# EAGLE design PhaetonArduinoBrd (EAGLE 7.4.0)
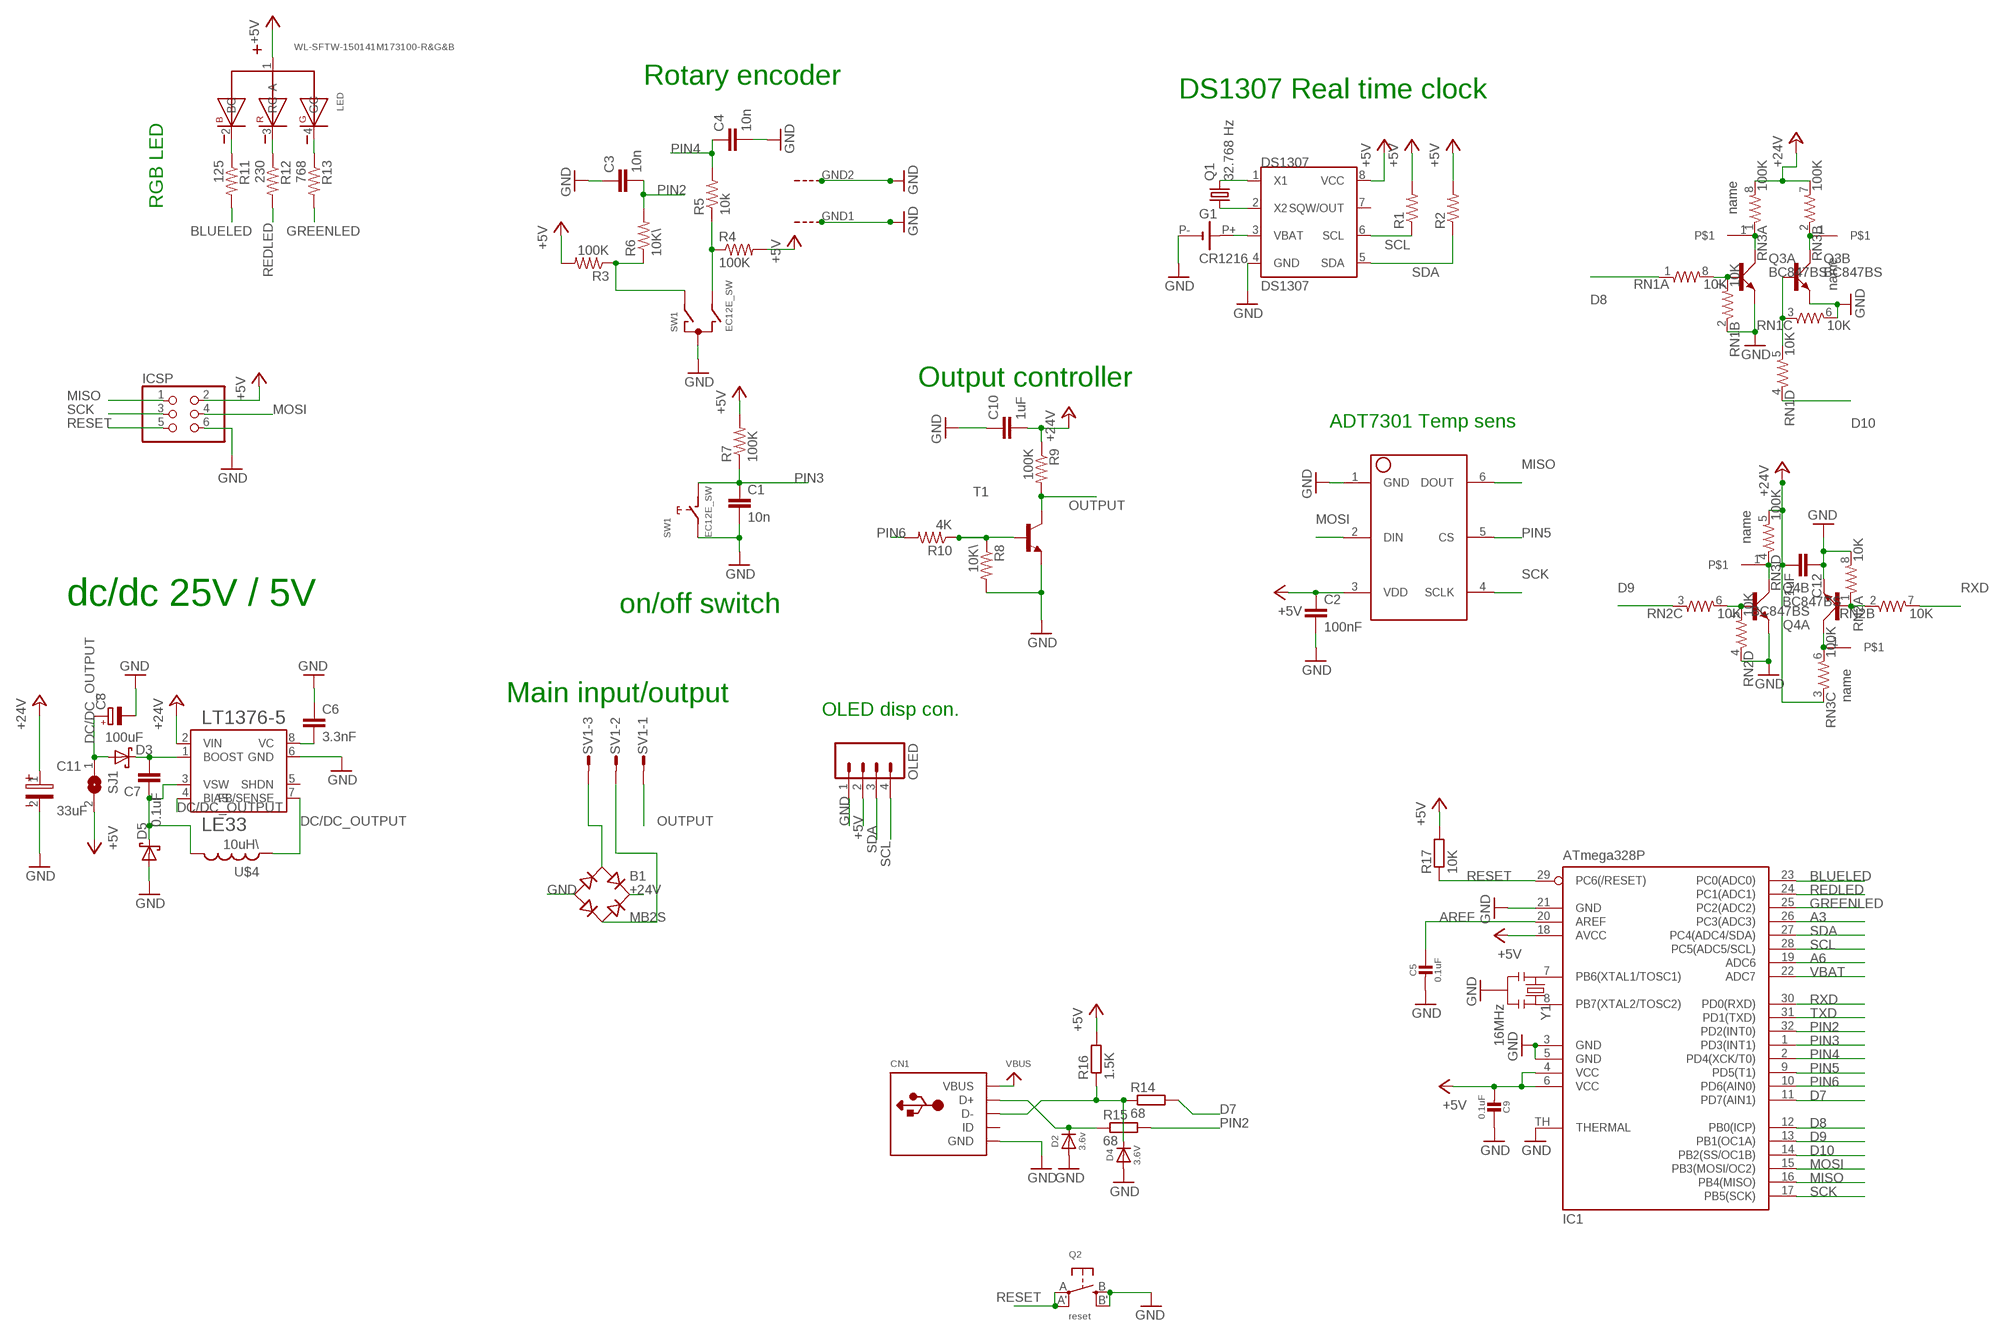
[diagram p0: schematic, sheet 1]

## Parts
ADT  ADT7301  [SOT23-6]
B1  MB2S  [SOIC-4]
C1  10n  C-EUC0504  [C0504]
C2  100nF  C-EUC0504  [C0504]
C3  10n  C-EUC0504  [C0504]
C4  10n  C-EUC0504  [C0504]
C5  0.1uF  CAP_CERAMIC_0805MP  [_0805MP]
C6  3.3nF  C-EUC0504  [C0504]
C7  0.1uF  C-EUC0504  [C0504]
C8  100uF  CPOL-EUCT7343  [CT7343]
C9  0.1uF  CAP_CERAMIC_0805MP  [_0805MP]
C10  1uF  C-EUC0402  [C0402]
C11  33uF  WCAP-ASLI_5X5.5(DXL)  [3X1.6X1.4(BXCXA)]
C12  1uF  C-EUC0402  [C0402]
CN1  USBMINIB  [USB-MINIB]
D2  3.6v  DIODESOD-323  [SOD-323]
D3  SCHOTTKY  [DO214]
D4  3.6V  DIODESOD-323  [SOD-323]
D5  SCHOTTKY  [DO214]
DS1307  DS1307  [SOIC-8]
G1  CR1216  [SMTU1225-LF]
IC1  ATmega328P  MEGA8-MI  [MLF32-TH]
ICSP  PINHD-2X3  [2X03]
LED  WL-SFTW-150141M173100-R&G&B  [3528-COMMON-ANODE]
LT1376-5  LE33  [SO08]
OLED  M04  [04P]
OUTPUT2  MINICONECTOR  [SMD]
Q1  32.768 Hz  CRYSTALTC26V  [TC26V]
Q2  reset  SWITCH_TACT_SMT4.6X2.8  [BTN_KMR2_4.6X2.8]
Q3  BC847BS  [SOT363_PHILIPS]
Q4  BC847BS  [SOT363_PHILIPS]
R1  RESISTOR  [0805]
R2  RESISTOR  [0805]
R3  100K  RESISTOR  [0805]
R4  100K  RESISTOR  [0805]
R5  10k  RESISTOR  [0805]
R6  10K\  RESISTOR  [0805]
R7  100K  RESISTOR  [0805]
R8  10K\  RESISTOR  [0805]
R9  100K  RESISTOR  [0805]
R10  4K  RESISTOR  [0805]
R11  125  RESISTOR  [0805]
R12  230  RESISTOR  [0805]
R13  768  RESISTOR  [0805]
R14  68  R-EU_R0603  [R0603]
R15  68  R-EU_R0603  [R0603]
R16  1.5K  R-EU_R0603  [R0603]
R17  10K  R-EU_R0603  [R0603]
RN1  10K  741-8_S  [741-8]
RN2  10K  741-8_S  [741-8]
RN3  100K  741-8_S  [741-8]
SJ1  SJ  [SJ]
SV1  MT6-3  [MT6-3]
SW1  EC12E_SW  [ALPS_EC12E_SW]
T1  BC818-16-NPN-SOT23-BEC  [SOT23-BEC]
U$3  MINICONECTOR  [SMD]
U$4  10uH\  LPS3314-103MRB  [103MRB]
U$5  MINICONECTOR  [SMD]
U$6  MINICONECTOR  [SMD]
Y1  16MHz  RESONATORSMD  [RESONATOR-SMD]

## Nets
+5V: ADT.3(VDD) C2.1 C9.2 DS1307.8(VCC) IC1.4(VCC) IC1.6(VCC) IC1.18(AVCC) ICSP.2 LED.1(A) OLED.2 R1.2 R2.2 R3.2 R4.2 R7.2 R16.2 R17.2 SJ1.2
+24V: B1.+ C10.2 C11.1 C12.2 LT1376-5.2(VIN) R9.1 RN3.3 RN3.5 RN3.7 RN3.8
A3: IC1.26(PC3(ADC3))
A6: IC1.19(ADC6)
AREF: C5.1 IC1.20(AREF)
BLUELED: IC1.23(PC0(ADC0)) R11.2
D7: IC1.11(PD7(AIN1)) R14.2
D8: IC1.12(PB0(ICP)) RN1.1
D9: IC1.13(PB1(OC1A)) RN2.3
D10: IC1.14(PB2(SS/OC1B)) RN1.4
D+: CN1.D+ D2.C R15.1
D-: CN1.D- D4.C R14.1 R16.1
DC/DC_OUTPUT: C8.+ D3.A LT1376-5.4(BIAS) LT1376-5.7(FB/SENSE) SJ1.1 U$4.2
GND: ADT.1(GND) B1.- C1.2 C2.2 C3.1 C4.2 C5.2 C6.1 C8.- C9.1 C10.1 C11.2 C12.1 CN1.GND D2.A D4.A D5.A DS1307.4(GND) G1.P-(-) IC1.3(GND) IC1.5(GND) IC1.21(GND) IC1.TH(THERMAL) ICSP.6 LT1376-5.6(GND) OLED.1 Q2.B'(S1) Q2.B(S) Q3.1(A:E) Q3.4(B:E) Q4.1(A:E) Q4.4(B:E) R8.2 RN1.2 RN1.6 RN2.4 RN2.8 SW1.C SW1.E SW1.GND1(G) SW1.GND2(G) T1.E Y1.2
GREENLED: IC1.25(PC2(ADC2)) R13.2
MISO: ADT.6(DOUT) IC1.16(PB4(MISO)) ICSP.1
MOSI: ADT.2(DIN) IC1.15(PB3(MOSI/OC2)) ICSP.4
N$1: LED.2(BC) R11.1
N$2: LED.3(RC) R12.1
N$3: LED.4(GC) R13.1
N$4: B1.~1(AC1) SV1.3
N$5: DS1307.2(X2) Q1.1
N$6: B1.~2(AC2) SV1.2
N$7: IC1.8(PB7(XTAL2/TOSC2)) Y1.3
N$8: IC1.7(PB6(XTAL1/TOSC1)) Y1.1
N$9: R8.1 R10.1 T1.B
N$10: OUTPUT2.1 Q3.6(A:C) RN3.1
N$11: C6.2 LT1376-5.8(VC)
N$12: C7.2 D3.C LT1376-5.1(BOOST)
N$13: Q3.3(B:C) RN3.2 U$3.1
N$14: C7.1 D5.C LT1376-5.3(VSW) U$4.1
N$15: Q4.2(A:B) RN2.1 RN2.2
N$16: Q3.2(A:B) RN1.7 RN1.8
N$17: Q3.5(B:B) RN1.3 RN1.5
N$18: Q4.5(B:B) RN2.5 RN2.6
N$19: Q4.3(B:C) RN3.4 U$6.1
N$20: Q4.6(A:C) RN3.6 U$5.1
N$21: R3.1 R6.1 SW1.A
N$22: R4.1 R5.1 SW1.B
N$24: DS1307.1(X1) Q1.2
OUTPUT: R9.2 SV1.1 T1.C
PIN2: C3.2 IC1.32(PD2(INT0)) R6.2 R15.2
PIN3: C1.1 IC1.1(PD3(INT1)) R7.1 SW1.D
PIN4: C4.1 IC1.2(PD4(XCK/T0)) R5.2
PIN5: ADT.5(CS) IC1.9(PD5(T1))
PIN6: IC1.10(PD6(AIN0)) R10.2
REDLED: IC1.24(PC1(ADC1)) R12.2
RESET: IC1.29(PC6(/RESET)) ICSP.5 Q2.A'(P1) Q2.A(P) R17.1
RXD: IC1.30(PD0(RXD)) RN2.7
SCK: ADT.4(SCLK) IC1.17(PB5(SCK)) ICSP.3
SCL: DS1307.6(SCL) IC1.28(PC5(ADC5/SCL)) OLED.4 R1.1
SDA: DS1307.5(SDA) IC1.27(PC4(ADC4/SDA)) OLED.3 R2.1
TXD: IC1.31(PD1(TXD))
VBAT: DS1307.3(VBAT) G1.P+(+) IC1.22(ADC7)
VBUS [power]: CN1.VBUS
Unconnected: CN1.ID DS1307.7(SQW/OUT)

## Notes on the sheet
- Rotary encoder
- DS1307 Real time clock
- RGB LED
- Output controller
- ADT7301 Temp sens
- on/off switch
- dc/dc 25V / 5V
- Main input/output
- OLED disp con.

## Power pins joined to a net without a drawn wire
SHDN: LT1376-5.5(SHDN)

## Library data of the parts
ADT = analogLIB:ADT7301
B1 = rectifier:MB*S: Bridge Rectifier Source: http://www.fairchildsemi.com/ds/MB/MB6S.pdf
C1-C4 C6 C7 = rcl:C-EU: CAPACITOR, European symbol
C5 C9 = microbuilder:CAP_CERAMIC: Ceramic Capacitors For new designs, use the packages preceded by an '_' character since they are more reliable: The following footprints should be used on most boards: _0402 - Standard footprint for regular board layouts _0603 - Standard footprint for regular board layouts _0805 - Standard footprint for regular board layouts _1206 - Standard footprint for regular board layouts For extremely tight-pitch boards where space is at a premium, the following 'micro-pitch' footprints can be used (smaller pads, no silkscreen outline, etc.): _0402MP - Micro-pitch footprint for very dense/compact boards _0603MP - Micro-pitch footprint for very dense/compact boards _0805MP - Micro-pitch footprint for very dense/compact boards _1206MP - Micro-pitch footprint for very dense/compact boards
C8 = rcl:CPOL-EU: POLARIZED CAPACITOR, European symbol
C10 C12 = resistor:C-EU: CAPACITOR, European symbol
C11 = Eagle_CAPACITORS:WCAP-ASLI: WCAP-ASLI Aluminum Electrolytic Capacitors Characteristics Aluminum Electrolytic Capacitor Recommended soldering: Reflow Operating temperature: -55 °C to +105 °C Low impedance product series Load life:2000 h @ +105 °C Package name and Variant abbreviation: Package: Package: B X C X A = length of the solder pad X width of the solder pad X pitch of the solder pad. Variant: D X L = Diameter of the body part X Height of the body part. <http://katalog.we-online.de/media/images/eisos/WCAP-ASLI_pf2.jpg> Details see: http://katalog.we-online.de/en/pbs/WCAP-ASLI?m Created: 2015-03-10 2015 (C) Wurth Elektronik
CN1 = microbuilder:USB: USB Connectors USBMINIB - Surface Mount Female Mini-B USB Connector 4UConnector: 06564
D2 D4 = microbuilder:DIODE: Diode SMA Model Volts Amps Type Vf Ir Digikey # Notes SSA34-E3 40V 3A Schottky 480mV @ 3A 200uA @ 40V SSA34-E3/61TGITR-ND CDBA120-G 20V 1A Schottky 500mV @ 1A 500uA @ 20V 641-1014-6-ND REEL MBRA210 10V 2A Schottky 350mV @ 2A 700uA @ 10V MBRA210LT3 SOD-123 Model Volts Amps Type Vf Ir Order # Notes BAT54T1G 30V 200mA Schottky 800mV @ 200mA 2uA @ 25V BAT54T1GOSTR-ND B0530W 30V 500mA Schottky 430mV @ 500mA 130uA @ 30V B0530W-FDICT-ND REEL MBR120 20V 1A Schottky 340mV @ 1A MBR120VLSFT1GOSCT-ND SOD-323 Model Volts Amps Type Vf Ir Order # Notes PMEG2005EJ 20V 500mA Schottky 355mV @ 500mA 568-4110-1-ND ZLLS410 10V 570mA Schottky 380mV @ 570mA ZLLS410CT-ND 1N4148WS 75V 150mA Silicon/Simple 1V 1N4148WSFSCT-ND REEL SOD-523 Model Volts Amps Type Vf Ir Order # Notes BAT54XV2 30V 200mA Schottky 0.8V @ 100mA BAT54XV2CT-ND TB751S 30V 30mA Schottky RB751S-40TE61CT-ND SOT23-R/W (R = Solder Paste/Reflow Ovens, W = Hand-Soldering) Model Volts Amps Type Vf Ir Order # Notes BAT54FILM 40V 300mA Schottky 497-7162-1-ND POWERDI-5 Model Volts Amps Type Vf Ir Order # Notes PDS560 60V 5A Schottky 670mV @ 5A 150uA @ 60V PDS560DICT-ND
D3 D5 = s1x_10:SCHOTTKY: S1A - S1M General Purpose Rectifiers Source: http://www.fairchildsemi.com/datasheets/S1/S1A.pdf
DS1307 = dallas:DS1307: I2C Serial RTC w/56 bytes battery backed RAM
G1 = battery:CR1216: LI BATTERY Sonnenschein
IC1 = microbuilder:MEGA8-MI: MICROCONTROLLER 8 Kbytes FLASH, 1 kbytes SRAM, 512 bytes EEPROM, USART, 6-channel 10 bit ADC, 2-channel 8 bit ADC Pin compatible with Atmega48, ATMega88, ATMega168 Source: avr.lbr; MPN: ATMEGA88PA-MU; OC_FARNELL: 1715491; OC_NEWARK: 15R0272
ICSP = SmartPrj:PINHD-2X3: PIN HEADER
LED = Wuerth_Elektronik_LEDs_rev15b:WL-SFTW: SMD full-color TOP LED Characteristics Low energy consumption High reliability Low current requirement Fast switching No UV/IR radiation High brightness RGB individual control Compact package outline Black surface Applications Flash light Switch indicators Equipments indicators Accent and decorative lighting Electronic signage Video displays Backlight for LCDs, PDAs and TVs Oven, microwave Street lighting Ideal for lateral coupling in light guides <http://katalog.we-online.de/media/images/eipal/WL-SFTW_pf2.jpg> Details see: http://katalog.we-online.de/en/led/WL-SFTW?m Updated 2015-04-10 2015 (C) Wurth Elektronik
LT1376-5 = lt1376:LE33: Very low drop voltage regulator with inhibit
OLED = con-amp-quick:M04: AMP QUICK CONNECTOR; OC_FARNELL: unknown; OC_NEWARK: unknown
OUTPUT2 U$3 U$5 U$6 = pcb_terminal:MINICONECTOR
Q1 = crystal:CRYSTAL: CRYSTAL; OC_FARNELL: unknown; OC_NEWARK: unknown
Q2 = microbuilder:SWITCH_TACT_SMT: SMT Tact Switches 6x6mm - Digikey: P12940SCT-ND KMR2 (4.6x2.8mm) - Digikey: 401-1426-1-ND EVQ-PQHB55 - Light Touch, 160GF (4.5x4.5mm) - Digikey: P8090SCT-ND KMT0 - KMT021 NGJ LHS (etc.) IP68/Waterproof - Digikey: CKN10289CT-ND
Q3 Q4 = transistor-small-signal:BC847BS: NPN general purpose double transistor Source: http://www.farnell.com/datasheets/2466.pdf
R1-R13 = SparkFun:RESISTOR: Resistor Basic schematic elements and footprints for 0603, 1206, and PTH 1/10th watt (small) resistors.
R14-R17 = resistor:R-EU_: RESISTOR, European symbol
RN1-RN3 = resistor-array:741-8_S: CTS 741 Series 8 Terminations, 4 Resistors
SJ1 = jumper:SJ: SMD solder JUMPER
SV1 = con-amp-mt6:MT6-3: AMP MT6 CONNECTOR; OC_FARNELL: unknown; OC_NEWARK: unknown
SW1 = switch-alps:EC12E_SW: ALPS rotary Encoder EC12E series with switch; MPN: EC12E2424407; OC_FARNELL: 1520813; OC_NEWARK: 74M1068
T1 = transistor:*-NPN-: NPN Transistror BF959 corrected 2008.03.06
U$4 = inductor-coilcraft3:LPS3314-103MRB: SMT Shielded Power inductors
Y1 = SparkFun:RESONATOR: Resonator Small SMD resonator. This is the itty bitty 10/20MHz resonators with built in caps. CSTCE10M0G55 and CSTCE20M0V53. Footprint has been reviewed closely but hasn't been tested yet.

## Net classes
1 power: width 0.305 mm

## Board
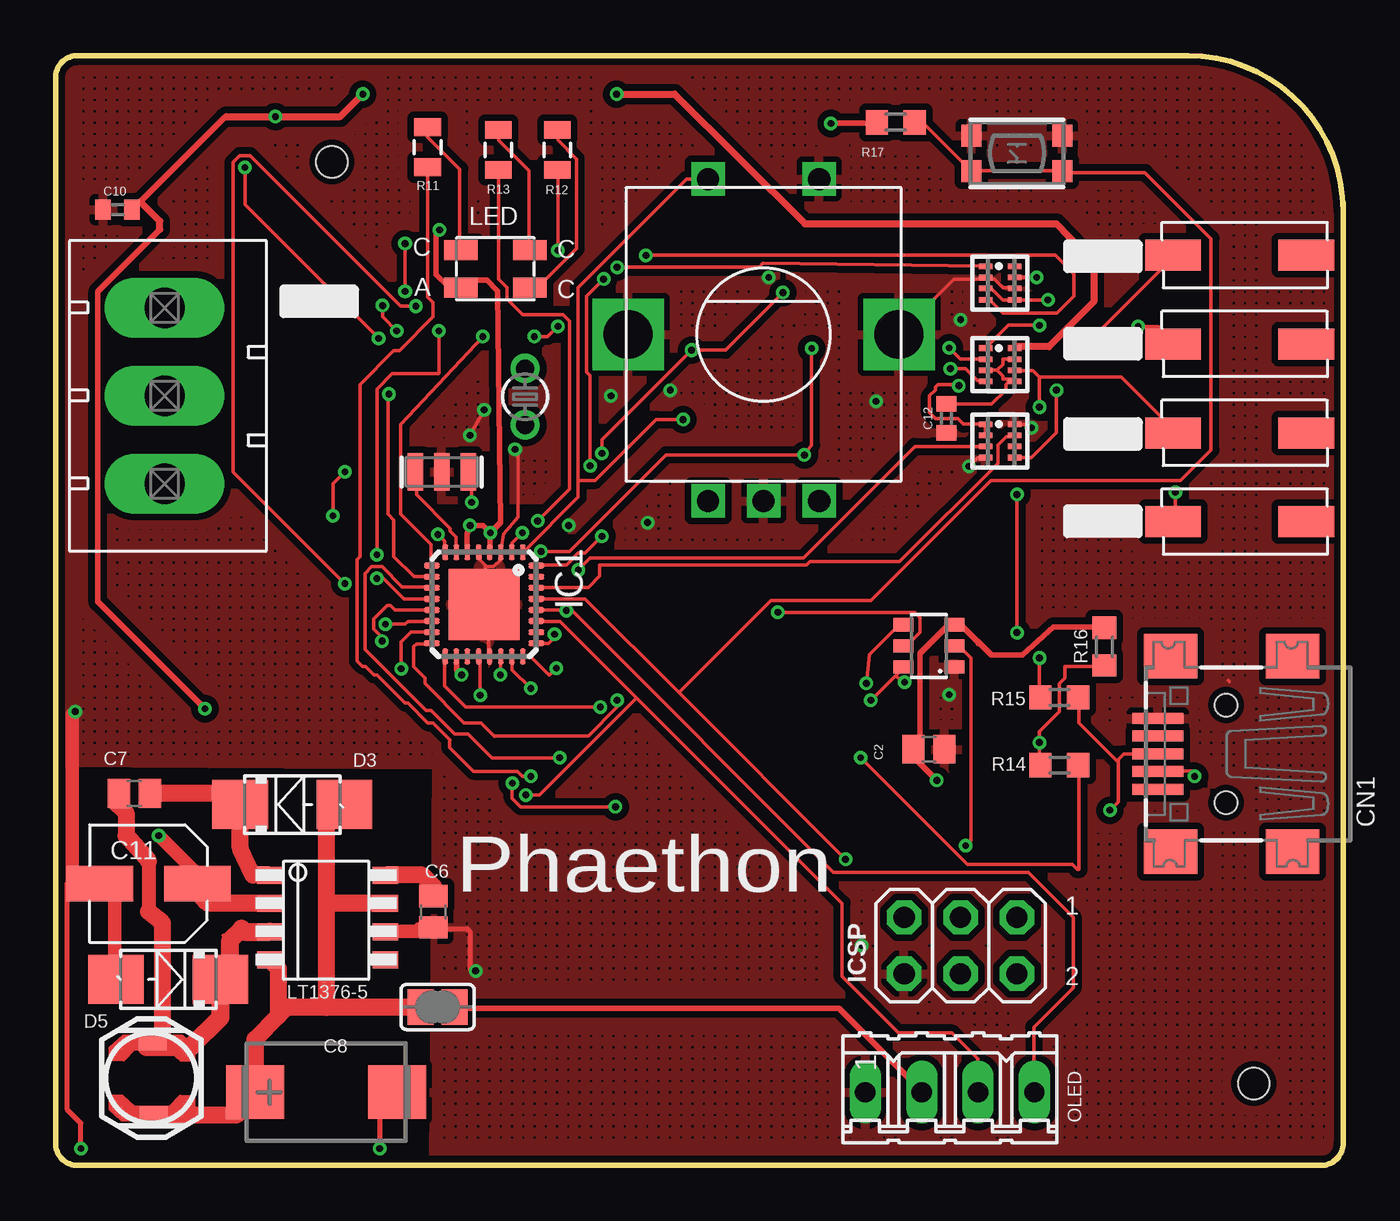
[diagram p1: board, top side]
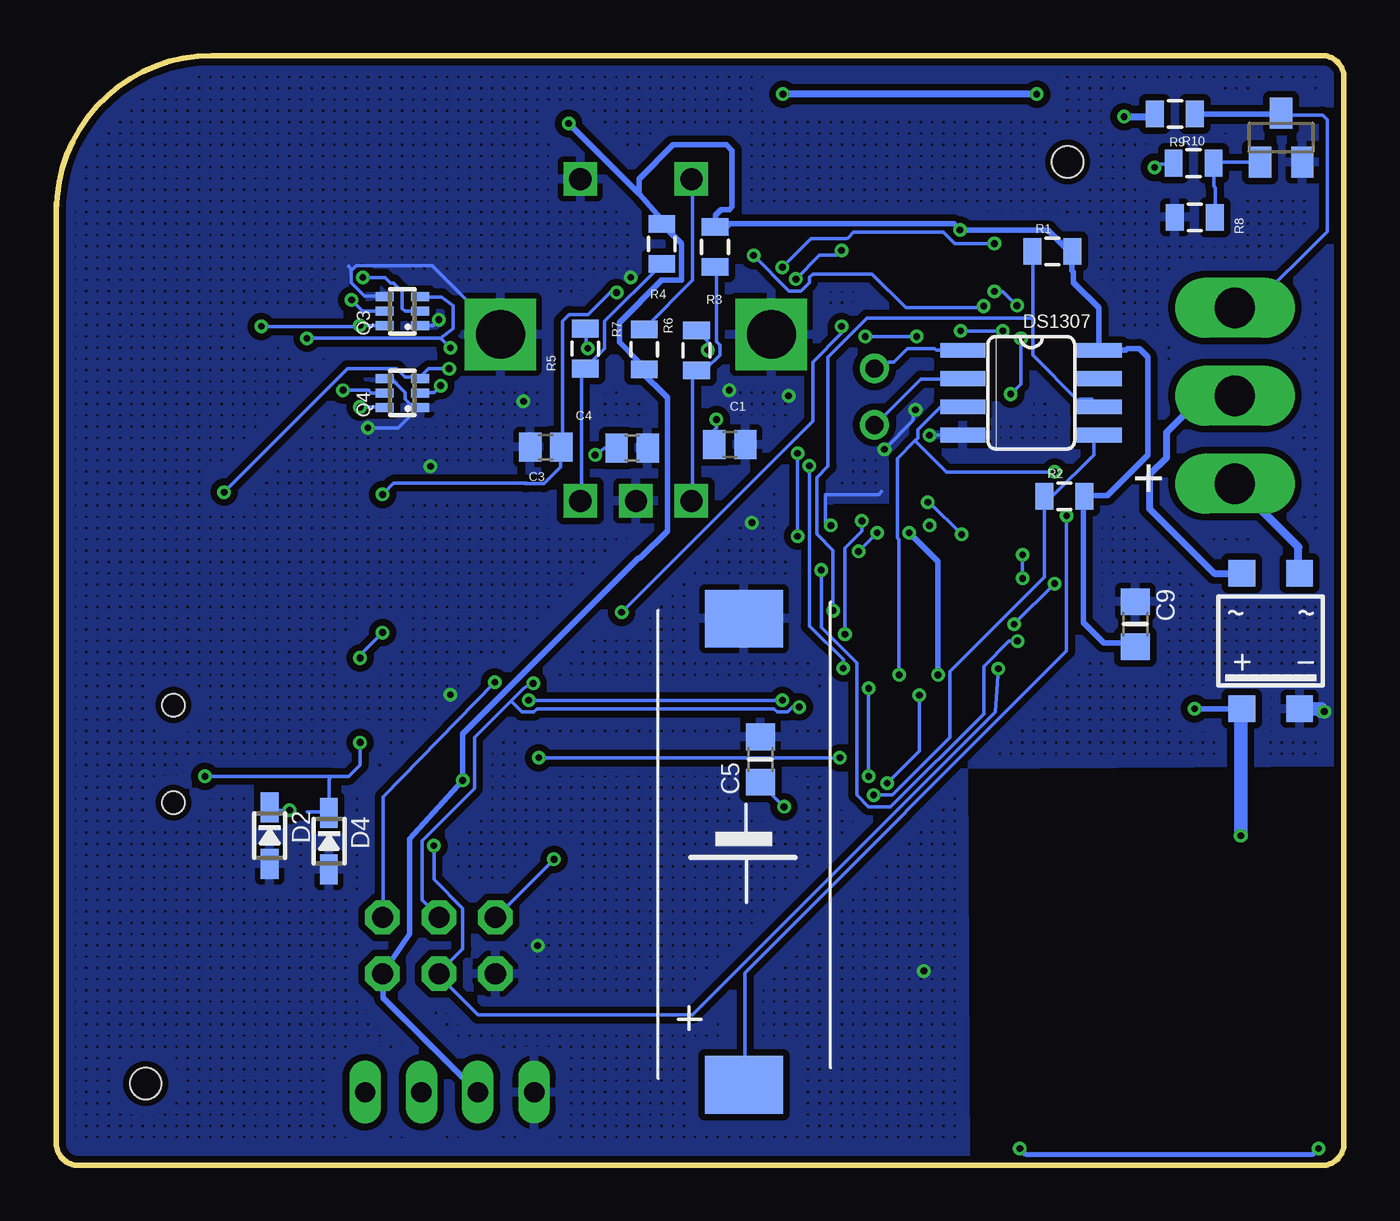
[diagram p2: board, bottom side, seen from below]

Size 58.04 x 50 mm. Coordinates in mm from the lower left corner, seen from the top.
Outline: 58,43.35 58,43
Outline: 58,43 58,1 arc-90 57,0 1,0 arc-90 0,1 0,49 arc-90 1,50 51,50 arc-90 58,43
Outline: 58.04,43.43 58,43
Copper layers (1*16): Top 0.035mm / dielectric 1.5mm / Bottom 0.035mm
Design rules "SeeedStudio_2layer_DRU_no_angle_20140221": minimum track width 6mil, minimum drill 12mil, track to track 6mil, track to pad 6mil, pad to pad 6mil, via to via 6mil, smd to smd 0mil, copper to edge 10mil, drill to drill 10mil, minimum pad ring 10mil, minimum via ring 6mil, stop-mask expansion 2mil, vias tented up to drill 100mil, thermal gap 10mil
Holes 1.4 mm at 12.45,45.21 53.98,3.68

### Footprints (pad centres in the part's own frame; a part is rotated, then mirrored left to right if it is on the bottom)
SOT23-6 = smd 0.6 x 0.9: 1 -0.95,-1.15; 2 0,-1.15; 3 0.95,-1.15; 4 0.95,1.15; 5 0,1.15; 6 -0.95,1.15
SOIC-4 = smd 1.2 x 1.2: + 1.3,3.05; - -1.3,3.05; ~1 -1.3,-3.05; ~2 1.3,-3.05
C0504 = smd 1 x 1.3: 1 -0.7,0; 2 0.7,0
_0805MP = smd 1.2 x 1.3: 1 -1.016,0; 2 1.016,0
CT7343 = smd 2.6 x 2.4: + -3.2,0; - 3.2,0
C0402 = smd 0.7 x 0.9: 1 -0.65,0; 2 0.65,0
3X1.6X1.4(BXCXA) = smd 3 x 1.6: 1 2.2,0; 2 -2.2,0
USB-MINIB = smd 0.5 x 2.308: D+ 0,4.064; D- -0.8,4.064; GND 1.6,4.064; ID 0.8,4.064; VBUS -1.6,4.064 | smd 2 x 2.4: GND1 -4.4,-2; GND2 -4.4,3.5; GND3 4.4,3.5; GND4 4.4,-2 | hole 1: -2.2,1; 2.2,1
SOD-323 = smd 1.35 x 0.8: A 1.27,0; C -1.27,0
DO214 = smd 2.5 x 2.2: A 2.35,0; C -2.35,0
SOIC-8 = smd 2.032 x 0.66: 1 -3.073,1.27; 2 -3.073,0; 3 -3.073,-1.27; 4 -3.073,-2.54; 5 3.073,-2.54; 6 3.073,-1.27; 7 3.073,0; 8 3.073,1.27
SMTU1225-LF = smd 2.6 x 3.5: P+ -10.5,0; P- 10.5,0
MLF32-TH = smd 0.7 x 0.25: 1 -2.35,1.75; 2 -2.35,1.25; 3 -2.35,0.75; 4 -2.35,0.25; 5 -2.35,-0.25; 6 -2.35,-0.75; 7 -2.35,-1.25; 8 -2.35,-1.75; 17 2.35,-1.75; 18 2.35,-1.25; 19 2.35,-0.75; 20 2.35,-0.25; 21 2.35,0.25; 22 2.35,0.75; 23 2.35,1.25; 24 2.35,1.75 | smd 0.25 x 0.7: 9 -1.75,-2.35; 10 -1.25,-2.35; 11 -0.75,-2.35; 12 -0.25,-2.35; 13 0.25,-2.35; 14 0.75,-2.35; 15 1.25,-2.35; 16 1.75,-2.35; 25 1.75,2.35; 26 1.25,2.35; 27 0.75,2.35; 28 0.25,2.35; 29 -0.25,2.35; 30 -0.75,2.35; 31 -1.25,2.35; 32 -1.75,2.35 | smd 3.2 x 3.2: TH 0,0
2X03 = drill 0.95 pad 1.55 octagon: 1 -2.54,-1.27; 2 -2.54,1.27; 3 0,-1.27; 4 0,1.27; 5 2.54,-1.27; 6 2.54,1.27
3528-COMMON-ANODE = smd 1.5 x 0.9: 1 1.55,0.85; 2 1.55,-0.85; 3 -1.55,0.85; 4 -1.55,-0.85
SO08 = smd 0.762 x 1.143: 1 -2.4,-2.54; 2 -1.13,-2.54; 3 0.14,-2.54; 4 1.41,-2.54; 5 1.41,2.667; 6 0.14,2.667; 7 -1.13,2.667; 8 -2.4,2.667
04P = drill 0.914 long: 1 -3.81,0; 2 -1.27,0; 3 1.27,0; 4 3.81,0
SMD = smd 2.5 x 1.4: 1 -3,0; 2 3,0
TC26V = drill 0.813: 1 -1.27,0; 2 1.27,0
BTN_KMR2_4.6X2.8 = smd 0.9 x 1: A 2.05,0.8; A' -2.05,0.8; B 2.05,-0.8; B' -2.05,-0.8
SOT363_PHILIPS = smd 0.4 x 0.8: 1 -0.65,-0.8; 2 0,-0.8; 3 0.65,-0.8; 4 0.65,0.8; 5 0,0.8; 6 -0.65,0.8
0805 = smd 0.8 x 1.2: 1 -0.9,0; 2 0.9,0
R0603 = smd 1 x 1.1: 1 -0.85,0; 2 0.85,0
741-8 = smd 0.25 x 0.61: 1 -0.75,-0.65; 2 -0.25,-0.65; 3 0.25,-0.65; 4 0.75,-0.65; 5 0.75,0.65; 6 0.25,0.65; 7 -0.25,0.65; 8 -0.75,0.65
SJ = smd 1.168 x 1.6: 1 -0.762,0; 2 0.762,0
MT6-3 = drill 1.803 long: 1 2.54,0; 2 6.502,0; 3 10.465,0
ALPS_EC12E_SW = drill 1 square: A -2.5,-7.5; B 2.5,-7.5; C 0,-7.5; D -2.5,7; E 2.5,7 | drill 2.2 square: GND1 -6.1,0; GND2 6.1,0
SOT23-BEC = smd 1 x 1.4: B -0.95,-1.1; C 0,1.1; E 0.95,-1.1
103MRB = smd 0.66 x 1.27: 1 -1.586,0.066; 2 1.605,0.107
RESONATOR-SMD = smd 0.7 x 1.7: 1 -1.2,0; 2 0,0; 3 1.2,0

### Placement (x,y rotation side)
ADT  39.34,23.4 90 top
B1  3.3,23.62 180 bottom
C1  27.66,32.47 0 bottom
C2  39.34,18.75 0 top
C3  35.95,32.35 0 bottom
C4  32.06,32.31 0 bottom
C5  26.29,18.29 90 bottom
C6  17.02,11.43 90 top
C7  3.56,16.76 0 top
C8  12.19,3.3 0 top
C9  9.4,24.38 270 bottom
C10  2.79,43.05 0 top
C11  4.19,12.7 0 top
C12  40.13,33.66 90 top
CN1  53.72,18.54 90 top
D2  48.39,14.86 270 bottom
D3  10.67,16.26 0 top
D4  45.72,14.61 270 bottom
D5  5.08,8.38 180 top
DS1307  14.09,35.44 0 bottom
G1  27.03,14.13 90 bottom
IC1  19.3,25.27 270 top
ICSP  40.77,9.91 180 top
LED  19.81,40.39 180 top
LT1376-5  12.19,10.67 270 top
OLED  40.29,3.3 0 top
OUTPUT2  53.34,37 0 top
Q1  21.15,34.63 90 top
Q2  43.31,45.59 180 top
Q3  42.42,38.48 90 bottom
Q4  42.42,34.8 90 bottom
R1  13.14,41.17 0 bottom
R2  12.6,30.14 0 bottom
R3  28.33,41.38 90 bottom
R4  30.73,41.51 90 bottom
R5  34.18,36.8 90 bottom
R6  29.16,36.72 90 bottom
R7  31.51,36.77 270 bottom
R8  6.72,42.71 180 bottom
R9  7.62,47.36 0 bottom
R10  6.77,45.15 180 bottom
R11  16.76,45.87 270 top
R12  22.61,45.75 270 top
R13  19.94,45.75 270 top
R14  45.21,18.03 0 top
R15  45.21,21.08 180 top
R16  47.24,23.37 90 top
R17  37.85,46.99 180 top
RN1  42.55,39.75 270 top
RN2  42.55,32.64 270 top
RN3  42.55,36.07 270 top
SJ1  17.21,7.14 0 top
SV1  4.91,41.17 270 top
SW1  31.9,37.44 0 top
T1  2.83,46.3 0 bottom
U$3  53.34,41 0 top
U$4  4.32,3.94 270 top
U$5  53.34,33 0 top
U$6  53.34,29 0 top
Y1  17.4,31.24 0 top

### Tracks (layer width: path | path; a pad name or v marks a point on that pad's centre or on a via)
+5V  (via drill 0.3, 0.3 pad 0.25)
  Top 0.152: 17.98,7.09 SJ1.2 | 39.01,3.35 OLED.2 | 36.96,46.94 R17.2 | 40.31,24.43 40.46,24.31 ADT.3 40.54,24.31 40.69,24.43 | 38.94,19.05 38.71,18.82 C2.1 38.71,18.75 38.71,18.34 | 41.53,23.47 41.52,23.61 41.53,23.62 | 18.06,22.86 IC1.18 | 19.58,27.66 IC1.4 | 18.29,39.55 LED.1 18.29,39.62 | 18.54,27.64 18.54,27.69 18.55,27.67 IC1.6 | 18.54,28.45 18.54,28.7 v18.67,28.83 | 47.24,24.26 R16.2
  Top 0.254: 17.98,7.09 35.28,7.09 39.01,3.35 | 40.31,24.43 38.94,23.06 38.94,19.05 | 40.69,24.43 41.52,23.61 | 38.71,18.34 v39.7,17.35 | 18.06,22.86 18.06,22.33 v18.29,22.1 | v19.58,28.5 20.04,28.96 19.91,39.4 19.43,39.88 18.6,39.88 LED.1 17.65,39.62 | 18.54,27.69 18.54,28.45 v18.67,28.83 19.25,28.83 v19.58,28.5 | 19.58,27.66 v19.58,28.5 | 47.24,24.26 44.96,24.26 43.56,22.99 42.16,22.99 41.53,23.62 | 36.96,46.94 v34.92,46.94 | 18.29,39.62 17.65,39.62 | 17.65,39.62 17.14,40.13 17.14,41.99 v17.3,42.14
  Bottom 0.152: 30.79,42.67 30.79,42.44 R4.2 30.71,42.37 | 28.35,42.29 R3.2 28.27,42.22 28.19,42.14 | 9.6,23.55 9.45,23.39 C9.2 | 11.73,30.1 R2.2 11.66,30.18 | 31.77,35.89 R7.2 31.7,35.81 | 12.27,40.31 12.19,40.23 | 11.05,36.73 DS1307.8 10.97,36.73 | 12.27,41.15 R1.2 12.34,41.15 | 9.83,36.73 9.75,36.8 | 43.28,8.61 ICSP.2 43.28,8.69 | 39.09,3.35 OLED.2 | 31.7,27.36 31.77,27.36
  Bottom 0.254: 11.73,30.1 11.73,24.46 10.82,23.55 9.6,23.55 | 11.05,36.73 11.05,38.63 12.19,39.78 12.19,40.23 | 12.27,41.15 12.27,40.31 | 11.66,30.18 10.67,30.18 8.84,32 8.84,36.42 9.22,36.8 9.75,36.8 | 10.97,36.73 9.83,36.73 | 43.28,8.61 43.28,7.54 39.09,3.35 | 43.28,8.69 42.9,9.25 42.09,10.44 42.09,14.71 v39.7,17.35 39.7,19.43 31.77,27.36 | 31.7,27.36 30.48,28.57 30.48,34.59 31.7,35.81 | v18.29,22.1 18.29,27.2 v19.58,28.5 | 12.34,41.15 13.34,42.14 v17.3,42.14 17.58,42.42 27.69,42.42 27.96,42.14 28.19,42.14 | 31.77,35.89 31.77,36.22 32.64,37.08 32.64,37.97 30.73,39.88 29.84,39.88 29.84,41.5 29.87,41.53 29.87,41.55 R4.2 | 30.79,42.67 31.76,43.78 | 31.76,43.78 v34.92,46.94 | 31.76,43.78 31.76,44.44 30.23,45.97 27.81,45.97 27.56,45.72 27.56,43.18 27.69,43.05 28.07,43.05 28.32,42.8 R3.2
+24V  (via drill 0.3)
  Top 0.152: 43.2,36.88 RN3.8 RN3.7 | 7.7,47.24 C10.2 7.62,47.24 | 9.91,12.04 LT1376-5.2 | C12.2 42.16,34.29 42.8,34.92 42.8,35.18 42.93,35.31 43.18,35.31 RN3.5 43.08,35.43 42.67,35.43 42.67,35.56 42.41,35.82 | RN3.3 42.41,35.82 | RN3.7 42.68,36.32 42.67,36.32 42.67,36.08 42.41,35.82 | 43.31,36.32 43.18,36.32 RN3.7
  Top 0.254: 4.7,42.16 1.91,39.37 1.91,25.38 1.93,25.38 v6.73,20.57 | 7.62,47.23 3.82,43.43 C10.2
  Top 0.305: 43.2,36.88 44.76,36.88 46.76,38.91 46.76,40.66 45.09,42.42 33.76,42.42 27.89,48.26 v25.27,48.26 | 4.7,42.16 4.7,42.55 3.82,43.43 | 7.7,47.24 v9.91,47.24 12.83,47.24 v13.84,48.26 | C11.1 6.39,12.94 6.48,13.03 | 6.62,12.05 7,12.05 7.24,11.81 7.24,12.27 6.2,13.31
  Top 0.61: 6.48,13.03 6.2,13.31 v4.65,14.86
  Top 0.762: LT1376-5.2 9.64,11.81 7.24,11.81 6.86,11.81 6.62,12.05
  Bottom 0.152: 4.65,20.5 B1.+
  Bottom 0.254: B1.+ v6.73,20.57
  Bottom 0.305: v9.91,47.24 8.63,47.24 R9.1 | v13.84,48.26 v25.27,48.26
  Bottom 0.61: v4.65,14.86 4.65,20.5
AREF  (via drill 0.3)
  Top 0.152: v19.13,21.18 19.13,22.86 IC1.20 | v20.57,17.22 20.57,16.54 20.95,16.15 v25.22,16.15
  Bottom 0.152: v19.13,21.18 19.13,18.67 v20.57,17.22 | v25.22,16.15 26.29,17.22 C5.1
BLUELED  (via drill 0.3)
  Top 0.152: v21.41,21.49 20.57,22.33 20.57,22.86 IC1.23 | v21.41,17.53 21.03,17.53 20.8,17.75 18.82,17.75 17.75,18.82 17.75,19.13 17.78,19.18 17.02,19.94 16.76,19.94 15.88,20.83 15.75,20.83 14.48,22.1 14.35,22.1 13.97,22.48 13.84,22.48 13.59,22.73 13.59,27.3 13.72,27.43 13.72,35.18 15.24,36.7 15.49,36.7 17.02,38.23 17.02,38.86 16.76,39.12 R11.2
  Bottom 0.152: v21.41,17.53 v21.41,21.49
D7  (via drill 0.3)
  Top 0.152: v22.71,18.36 19.66,18.36 18.59,19.43 17.98,19.43 16.92,20.5 16.69,20.5 13.95,23.24 13.95,26.67 14.25,26.98 14.71,26.98 15.62,26.06 16.92,26.06 IC1.11 | v36.27,18.36 41.07,13.56 45.8,13.56 46.02,13.34 46.1,13.34 46.1,18.03 R14.2
  Bottom 0.152: v36.27,18.36 v22.71,18.36
D8  (via drill 0.3)
  Top 0.152: v14.48,27.51 14.48,34.98 15.16,35.66 17.25,35.66 17.27,35.69 v17.27,37.59 | v14.48,26.44 14.78,26.44 15.7,25.53 16.92,25.53 IC1.12 | 41.83,40.46 RN1.1 41.88,40.51 31.88,40.64 31.7,40.46 v25.3,40.46 | v15.37,37.59 14.73,38.23 v14.73,38.73 | v15.75,41.53 v15.75,39.37
  Bottom 0.152: v25.3,40.46 24,41.76 22.4,41.76 22.35,41.78 22.1,42.04 18.03,42.04 17.53,41.53 v15.75,41.53 | v14.48,26.44 v14.48,27.51 | v15.37,37.59 v17.27,37.59 | v14.73,38.73 15.37,39.37 v15.75,39.37
D9  (via drill 0.3)
  Top 0.152: v23.55,26.82 24.08,27.36 33.68,27.36 38.71,32.38 41.83,32.38 RN2.3 | v14.71,23.62 14.71,23.77 14.33,24.16 14.33,24.61 14.94,25.22 15.09,25.22 15.29,25.02 IC1.13
  Bottom 0.152: v23.55,26.82 23.55,24.23 21.95,22.63 21.95,16.69 21.41,16.15 20.42,16.15 16.23,20.34 16.23,22.48 15.09,23.62 v14.71,23.62
D10  (via drill 0.3)
  Top 0.152: v26.59,41 45.03,41 45.87,40.16 45.87,39.17 45.11,38.41 42.67,38.41 42.14,38.94 41.91,38.94 RN1.4 | v16.23,38.71 15.54,38.71 8.76,45.49 8.31,45.49 8,45.19 8,31.24 v13.03,26.21 | v14.86,24.38 15.75,24.38 15.88,24.51 IC1.14
  Bottom 0.152: v26.59,41 24.99,39.4 24.46,39.4 24.08,39.78 24.08,40.01 23.93,40.16 21.26,40.16 19.74,38.63 16.31,38.63 v16.23,38.71 | v14.86,24.38 v13.03,26.21
D+  (via drill 0.3)
  Top 0.152: v47.5,16 47.88,16.38 47.88,18.16 | 47.88,18.16 47.88,18.29 48.13,18.54 CN1.D+ | 47.88,18.16 46.1,19.94 46.1,21.08 R15.1
  Bottom 0.152: v47.5,16 48.39,16 D2.C
D-  (via drill 0.3)
  Top 0.152: R14.1 44.32,18.03 v44.32,19.05 44.32,19.56 45.21,20.45 45.21,21.72 45.47,21.97 45.47,22.48 47.24,22.48 R16.1 | v51.31,17.53 51.31,17.78 49.66,17.78 CN1.D-
  Bottom 0.152: 46.71,15.93 45.72,15.93 D4.C 45.72,17.4 45.59,17.53 | 45.59,17.53 44.83,17.53 44.32,18.03 v44.32,19.05 | 45.59,17.53 v51.31,17.53
DC/DC_OUTPUT
  Top 0.406: 4.06,2.29 4.38,2.29 U$4.2
  Top 0.762: 4.06,2.29 8.13,2.29 | SJ1.1 16.43,7.11 12.19,7.11 | 12.19,7.11 10.41,7.11 10.03,6.73 | 10.03,6.73 8.99,5.69 C8.+ | LT1376-5.4 10.03,8.88 10.03,6.73 | D3.A 12.19,15.43 12.19,11.81 | 12.19,11.81 12.19,7.11 | LT1376-5.7 14.85,11.81 12.19,11.81
  Top 0.813: 8.13,2.29 8.99,3.15 C8.+
GND  (via drill 0.3, 0.3 pad 0.25)
  Top 0.152: RN1.6 43.13,39.55 42.67,39.55 42.29,39.93 41.91,39.93 RN1.2 41.83,39.93 40.46,39.93 38.02,37.49 SW1.GND2 | v43.97,33.22 43.81,33.38 43.2,33.38 RN2.8 | IC1.21 19.51,22.94 19.51,25.07 IC1.TH 19.36,25.3 19.36,26.98 19.39,27.01 | 19.39,27.01 19.13,27.28 19.13,27.58 IC1.5 | 19.39,27.01 19.43,26.98 19.74,26.98 20.04,27.28 20.04,27.58 IC1.3 20.18,28.44 20.83,29.21 20.83,32.13 v20.7,32.26 | 52.88,21.79 52.82,21.84 | v18.67,32.89 v19.3,34.04 | RN2.4 41.54,31.89 v41.15,31.5
  Top 0.229: 0.76,12.83 0.51,12.7 0.51,2.54 1.14,1.91 v1.14,0.76 | v14.61,0.76 14.61,3.17 14.73,3.3 C8.- | C6.1 17.27,10.67 18.54,10.67 18.67,10.54 18.67,8.89 18.92,8.64 v18.92,8.76
  Top 0.305: 0.89,12.7 1.02,12.7 C11.2 2.41,12.7 2.67,12.45
  Top 0.61: v0.89,20.45 0.76,20.32 0.76,12.83 0.89,12.7 | 2.67,12.45 2.67,8.38 D5.A | LT1376-5.6 14.86,10.54 16.26,10.54 16.38,10.67 17.02,10.67 C6.1
  Bottom 0.152: v43.97,33.22 42.6,33.22 41.68,34.14 Q4.1 41.83,34.06 42.29,34.52 42.29,34.82 42.9,35.43 43.2,35.43 Q4.4 | 44.73,40.39 44.73,39.78 44.12,39.17 43.28,39.17 Q3.4 | 44.73,40.39 44.83,40.52 | 44.73,40.39 44.65,40.39 44.5,40.54 41.07,40.54 38.02,37.49 SW1.GND2 | v20.7,32.26 19.43,33.53 v19.3,34.04 | v18.67,32.89 17.27,32.89 DS1307.4 | v23.11,28.83 23.37,28.83 23.37,30.23 20.95,30.23 20.83,30.35 | Q3.1 41.04,37.83 v40.77,38.1
  Bottom 0.229: v1.14,0.76 1.4,0.51 14.35,0.51 v14.61,0.76
  Bottom 0.61: B1.- 1.91,20.57 1.02,20.57 1.02,20.45 v0.89,20.45
  other vias: 40.26,21.21 36.32,9.91 36.96,34.42 25.02,34.67 27.69,34.92 26.67,28.96 32.13,40.01
  pour Top (isolate 0.305, rank 2, hatched): 58.04,0.13 58.17,50.04 0,50.04 0,18.16 17.14,18.03 17.02,0 47.62,0
  pour Bottom (isolate 0.305, rank 2, hatched): -0.13,18.16 17.14,18.03 17.04,-0.08 58.04,0.25 58.04,49.91 2.67,49.91 0.13,49.78 0.13,46.61
GREENLED  (via drill 0.3)
  Top 0.152: IC1.25 22.2,23.52 22.21,23.51 22.48,23.77 v22.48,23.93 | v21.72,29.03 23.16,30.48 23.16,38.02 22.86,38.33 21.03,38.33 20.34,39.01 20.34,39.55 19.96,39.93 19.96,44.81 R13.2
  Bottom 0.152: v21.72,29.03 21.72,28.57 22.48,27.81 v22.48,23.93
MISO  (via drill 0.3)
  Top 0.152: 37.83,22.06 38.18,22.4 ADT.6 | 37.83,22.06 v36.73,20.95 | 37.83,22.06 v38.25,21.77 | v25.3,20.95 25.3,20.65 24,19.36 19.81,19.36 19.79,19.33 19.18,19.94 18.41,19.94 16.64,21.72 16.64,21.97 16.13,22.48 16.13,23.37 16.26,23.5 16.89,23.5 16.92,23.52 IC1.16
  Bottom 0.152: v36.73,20.95 v25.3,20.95 | v38.25,21.77 43.28,16.61 43.28,11.2 ICSP.1
MOSI  (via drill 0.3)
  Top 0.152: v41,14.4 41.22,14.63 41.22,22.86 40.69,23.39 40.54,23.39 ADT.2 | IC1.15 16.02,24.02 15.57,23.57 v15.57,22.38
  Bottom 0.152: v15.57,22.38 15.7,20.42 29.34,6.78 39.01,6.78 40.77,8.53 ICSP.4 40.77,8.69 39.7,9.75 39.7,11.58 41,12.88 v41,14.4
N$1
  Top 0.152: R11.1 16.76,46.33 18.21,44.88 18.21,41.3 LED.2
N$2
  Top 0.152: R12.1 22.63,46.63 22.63,46.18 23.47,45.34 23.47,41.3 21.72,39.55 21.41,39.55 LED.3
N$3
  Top 0.152: R13.1 19.96,46.63 19.96,46.18 21.34,44.81 21.34,41.3 LED.4
N$4
  Bottom 0.152: 2.06,26.75 B1.~1 | 4.88,30.63 SV1.3
  Bottom 0.356: 2.06,26.75 2.06,27.85 SV1.3
N$5
  Bottom 0.152: DS1307.2 17.22,35.43 19.05,35.43 21.11,33.38 Q1.1
N$6
  Bottom 0.152: 4.65,26.75 B1.~2 | 4.95,34.59 SV1.2
  Bottom 0.305: B1.~2 5.84,26.67 8.76,29.59 8.76,31.11 8,31.88 8,33.02 6.43,34.59 4.99,34.59 SV1.2
N$7  (via drill 0.3)
  Top 0.152: v17.22,28.42 17.53,28.12 17.53,27.66 IC1.8 | v18.75,29.87 18.75,31.17 18.67,31.24 Y1.3
  Bottom 0.152: v17.22,28.42 18.67,29.87 v18.75,29.87
N$8
  Top 0.152: IC1.7 18.05,28.3 17.78,28.57 17.78,28.7 16.26,30.23 16.26,31.18 Y1.1
N$9
  Bottom 0.152: R8.1 5.79,42.75 5.79,44.04 5.87,44.12 5.87,45.11 R10.1 5.87,45.19 3.81,45.19 T1.B
N$10  (via drill 0.3)
  Top 0.152: v48.77,37.8 49.68,37.8 50.44,37.03 OUTPUT2.1 | v44.32,37.85 42.92,37.85 RN3.1
  Bottom 0.152: v48.77,37.8 44.35,37.8 v44.32,37.85 44.31,37.83 Q3.6
N$11
  Top 0.762: C6.2 17.02,12.57 16.51,13.08 14.87,13.08 LT1376-5.8
N$12
  Top 0.762: LT1376-5.1 9.64,13.08 8.89,13.08 8.32,14.29 D3.C 7.81,16.76 C7.2
N$13  (via drill 0.3)
  Top 0.152: v46.71,37.26 50.44,41 U$3.1 | v40.26,36.83 40.77,36.32 41.78,36.32 RN3.2
  Bottom 0.152: v46.71,37.26 40.69,37.26 | 40.69,37.26 v40.26,36.83 | 40.69,37.26 40.13,37.69 40.13,38.73 40.64,39.12 41.53,39.12 Q3.3
N$14
  Top 0.152: 2.9,16.76 C7.1 | 7.54,10.36 7.87,10.16
  Top 0.406: U$4.1 5.84,5.52 5.84,5.33
  Top 0.635: 4.19,13.72 4.19,11.43
  Top 0.762: 4.83,5.33 4.83,10.92 4.19,11.43 | 4.19,13.72 3.17,14.86 3.17,15.88 2.79,16.26 2.79,16.76 C7.1
  Top 0.813: 4.09,5.33 4.83,5.33 5.84,5.33 6.1,5.33 7.43,6.67 D5.C 7.87,8.83 7.87,10.16 8.38,10.67 8.52,10.53 LT1376-5.3
N$15  (via drill 0.3)
  Top 0.152: 40.69,35.18 v40.69,35.13 40.64,35.18 39.75,35.18 39.62,35.05 39.62,34.92 39.37,34.67 39.37,33.91 39.62,33.66 40.64,33.66 40.91,33.39 RN2.1 RN2.2
  Bottom 0.152: v40.69,35.13 41,34.82 41.6,34.82 Q4.2
N$16  (via drill 0.3)
  Top 0.152: 43.18,40.39 43.18,40.02 RN1.7 | 43.31,40.01 v44.2,40.01 | RN1.8 RN1.7 | RN1.7 v44.19,40 v44.2,40.01 | v44.2,40.01 RN1.7
  Bottom 0.152: Q3.2 42.29,38.48 42.42,38.61 42.42,39.37 42.8,39.75 42.95,39.75 RN1.7 v44.19,40 v44.2,40.01
N$17  (via drill 0.3)
  Top 0.152: RN1.3 42.16,39.5 42.67,38.99 43.18,38.99 RN1.5 43.31,38.99 v44.7,38.99
  Bottom 0.152: v44.7,38.99 44.2,38.48 Q3.5
N$18  (via drill 0.3)
  Top 0.152: RN2.6 RN2.5 43.95,31.89 45.09,33.02 v45.09,34.92
  Bottom 0.152: Q4.5 43.81,34.8 43.94,34.92 v45.09,34.92
N$19  (via drill 0.3)
  Top 0.152: v40.31,35.89 41,35.89 41.53,35.36 41.83,35.36 RN3.4 | v50.44,30.33 50.44,29.03 U$6.1
  Bottom 0.152: v40.31,35.89 41.22,35.89 41.6,35.51 Q4.3 41.68,35.51 42.29,35.51 42.67,35.89 44.88,35.89 v50.44,30.33
N$20  (via drill 0.3)
  Top 0.152: 44.32,35.51 48.01,35.51 50.44,33.07 U$5.1 | 44.32,35.51 44.02,35.81 RN3.6 | 44.32,35.51 v44.32,34.16
  Bottom 0.152: v44.32,34.16 43.31,34.16 43.29,34.15 Q4.6
N$21
  Bottom 0.152: R3.1 28.27,40.46 28.27,37.11 28.12,36.96 28.12,36.5 28.73,35.89 29.11,35.89 R6.1 29.18,35.81 29.34,35.66 29.34,29.95 SW1.A
N$22
  Bottom 0.152: SW1.B 34.37,29.95 34.34,30.1 34.34,35.89 R5.1 34.14,35.97 33.3,36.8 33.3,38.02 30.79,40.54 R4.1
N$23
  cutout Top: 16.13,29.72 22.99,29.72 22.99,27.3 16.13,27.3
  cutout Bottom: 16.13,29.72 22.99,29.72 22.99,27.3 16.13,27.3
N$24
  Bottom 0.152: DS1307.1 17.22,36.73 18.36,36.73 18.44,36.8 19.66,36.8 20.27,36.2 20.5,36.2 20.73,35.97 21.11,35.97 Q1.2
OUTPUT
  Bottom 0.152: SV1.1 4.88,38.63 4.19,38.63 0.76,42.06 0.76,47.12 0.96,47.31 2.92,47.31 T1.C
  Bottom 0.254: R9.2 2.87,47.36 T1.C
PIN2  (via drill 0.3)
  Top 0.152: v24.61,28.35 23.85,27.58 23.55,27.58 23.01,27.05 21.72,27.05 IC1.32 | v24.61,32.08 24.61,32.69 v28.65,36.73 30.18,36.73 v32.77,39.32 | v44.32,22.86 44.32,21.08 R15.2 | v43.31,30.23 v43.31,24
  Bottom 0.152: v24.61,32.08 v24.61,28.35 | v28.65,36.73 28.65,37.11 29.11,37.57 R6.2 | 36.83,30.71 36.04,30.71 35.28,31.47 35.28,32.31 C3.2 35.2,32.38 35.2,38.02 34.9,38.33 34.06,38.33 33.07,39.32 v32.77,39.32 | 36.83,30.71 36.88,30.71 | v43.31,24 44.32,22.99 v44.32,22.86 | v43.31,30.23 42.8,30.73 36.83,30.73 36.83,30.71
PIN3  (via drill 0.3)
  Top 0.152: 23.55,30.86 23.55,39.55 28.42,44.42 29.34,44.42 SW1.D | 23.55,30.86 23.55,30.1 21.11,27.66 IC1.1 | v28.27,33.6 27.05,33.6 24.31,30.86 23.55,30.86
  Bottom 0.152: 29.49,44.35 29.41,44.42 SW1.D 29.34,44.38 29.34,39.88 31.5,37.72 31.7,37.72 R7.1 | v28.27,33.6 28.27,33.22 28.35,33.15 28.35,32.54 C1.1
PIN4  (via drill 0.3)
  Top 0.152: v21.03,28.5 20.57,28.04 20.57,27.66 IC1.2 | v21.87,27.66 23.16,27.66 27.51,32 v33.73,32 34.06,32.46 v34.06,36.8
  Bottom 0.152: v21.87,27.66 v21.03,28.5 | v33.73,32 33.3,32.31 32.69,32.31 C4.1 | v34.06,36.8 34.14,36.88 34.14,37.64 R5.2
PIN5  (via drill 0.3)
  Top 0.152: v19.25,37.34 15.54,33.38 15.54,29.34 16.92,27.96 16.92,27.05 IC1.9 | v21.57,37.34 22.17,37.34 v22.63,37.8 | v32.54,24.92 38.71,24.92 38.94,24.69 38.94,24 38.41,23.47 38.25,23.47 ADT.5
  Bottom 0.152: v21.57,37.34 v19.25,37.34 | v22.63,37.8 22.63,37.49 23.93,36.2 23.93,33.53 v32.54,24.92
PIN6  (via drill 0.3)
  Top 0.152: v8.53,44.96 8.53,43.28 v14.55,37.26 | IC1.10 16.15,26.52 15.24,27.43 15.24,29.08 14.99,29.34 14.99,34.72 v15.01,34.75
  Bottom 0.152: v8.53,44.96 8.38,45.11 7.7,45.11 R10.2 | v14.55,37.26 14.55,35.2 v15.01,34.75
REDLED  (via drill 0.3)
  Top 0.152: IC1.24 21.4,22.92 22.23,22.1 22.25,22.1 v22.55,22.4 | v24.08,31.52 24.08,35.59 23.93,35.74 23.93,39.17 v24.69,39.93 | v22.63,41.22 22.63,44.81 R12.2
  Bottom 0.152: v22.55,22.4 22.55,22.78 24.08,24.31 v24.08,31.52 | v24.69,39.93 23.62,41 22.86,41 v22.63,41.22
RESET  (via drill 0.3)
  Top 0.152: R17.1 38.71,46.94 39.09,46.94 41.22,44.81 Q2.A 41.3,44.81 45.34,44.81 Q2.A' 45.41,44.73 49.07,44.73 52.05,41.76 52.05,32.23 50.67,30.86 42.14,30.86 36.73,25.45 32.23,25.45 28.08,21.3 | v35.59,13.79 28.08,21.3 | 28.08,21.3 23.85,25.53 21.72,25.53 IC1.29
  Bottom 0.152: v35.59,13.79 38.18,11.2 ICSP.5
RXD
  Top 0.152: RN2.7 43.13,32.84 42.82,32.84 42.44,32.46 42.44,31.62 38.02,27.2 33.98,27.2 33.83,27.05 24.51,27.05 24.51,26.54 24,26.04 21.67,26.04 IC1.30
SCK  (via drill 0.3)
  Top 0.152: v36.52,21.72 36.65,23.01 37.95,24.31 38.18,24.31 ADT.4 | v24.54,20.65 18.47,20.65 17.53,21.59 17.53,22.86 | 17.53,22.86 17.53,22.89 IC1.17 | 17.55,22.89 17.53,22.86
  Bottom 0.152: v36.52,21.72 36.75,21.61 36.96,21.49 37.53,20.92 | 37.53,20.92 39.17,19.28 39.17,16.99 41.53,14.63 41.53,11.96 40.77,11.2 ICSP.3 | v24.54,20.65 24.84,20.65 25.07,20.42 25.53,20.42 25.68,20.57 36.35,20.57 36.5,20.42 37.03,20.42 37.53,20.92
SCL  (via drill 0.3)
  Top 0.152: 23.01,25.02 23.24,25.02 35.05,13.21 43.81,13.21 45.85,11.18 45.85,8 44.07,6.22 44.07,3.33 OLED.4 | 23.01,25.02 IC1.28 | v23.01,24.99 23.01,25.02
  Bottom 0.152: 14.02,38.18 14.02,36.5 11.96,34.44 11.89,34.52 11.35,34.52 11.05,34.21 DS1307.6 | 14.02,38.18 14.02,41.15 R1.1 | 14.02,38.18 21.49,38.18 23.24,36.42 23.24,31.5 23.75,30.99 23.75,28.45 23.01,27.71 v23.01,24.99
SDA  (via drill 0.3)
  Top 0.152: OLED.3 41.56,4.8 40.39,5.97 37.97,5.97 35.43,8.51 35.43,11.81 26.18,21.07 | 26.18,21.07 22.73,24.51 21.67,24.51 IC1.27 | v21.18,16.69 21.79,16.69 26.18,21.07
  Bottom 0.152: DS1307.5 11.05,32.84 11.28,32.61 11.28,32 13.11,30.18 13.49,30.18 R2.1 13.49,30.1 13.49,26.52 17.75,22.25 17.75,19.28 20.34,16.69 v21.18,16.69
VBAT  (via drill 0.3)
  Top 0.152: v20.04,22.1 20.04,22.86 IC1.22 | v12.5,29.26 12.5,30.71 v13.03,31.24
  Bottom 0.152: v20.04,22.1 20.04,28.19 20.12,28.27 20.12,31.85 19.32,32.65 | 19.32,32.65 19.2,32.77 19.2,33.15 18.21,34.14 17.22,34.14 DS1307.3 | v12.5,29.26 12.5,23.16 26.98,8.69 26.98,3.66 G1.P+ | v13.03,31.24 17.91,31.24 19.32,32.65

### Text on the board
tNames: W2 | W/W1 | Y/Y1 | Y2 | G | Phaethon | 1 | 2
bNames: +